# Altium schematic sheet charger_module.SchDoc
size A4
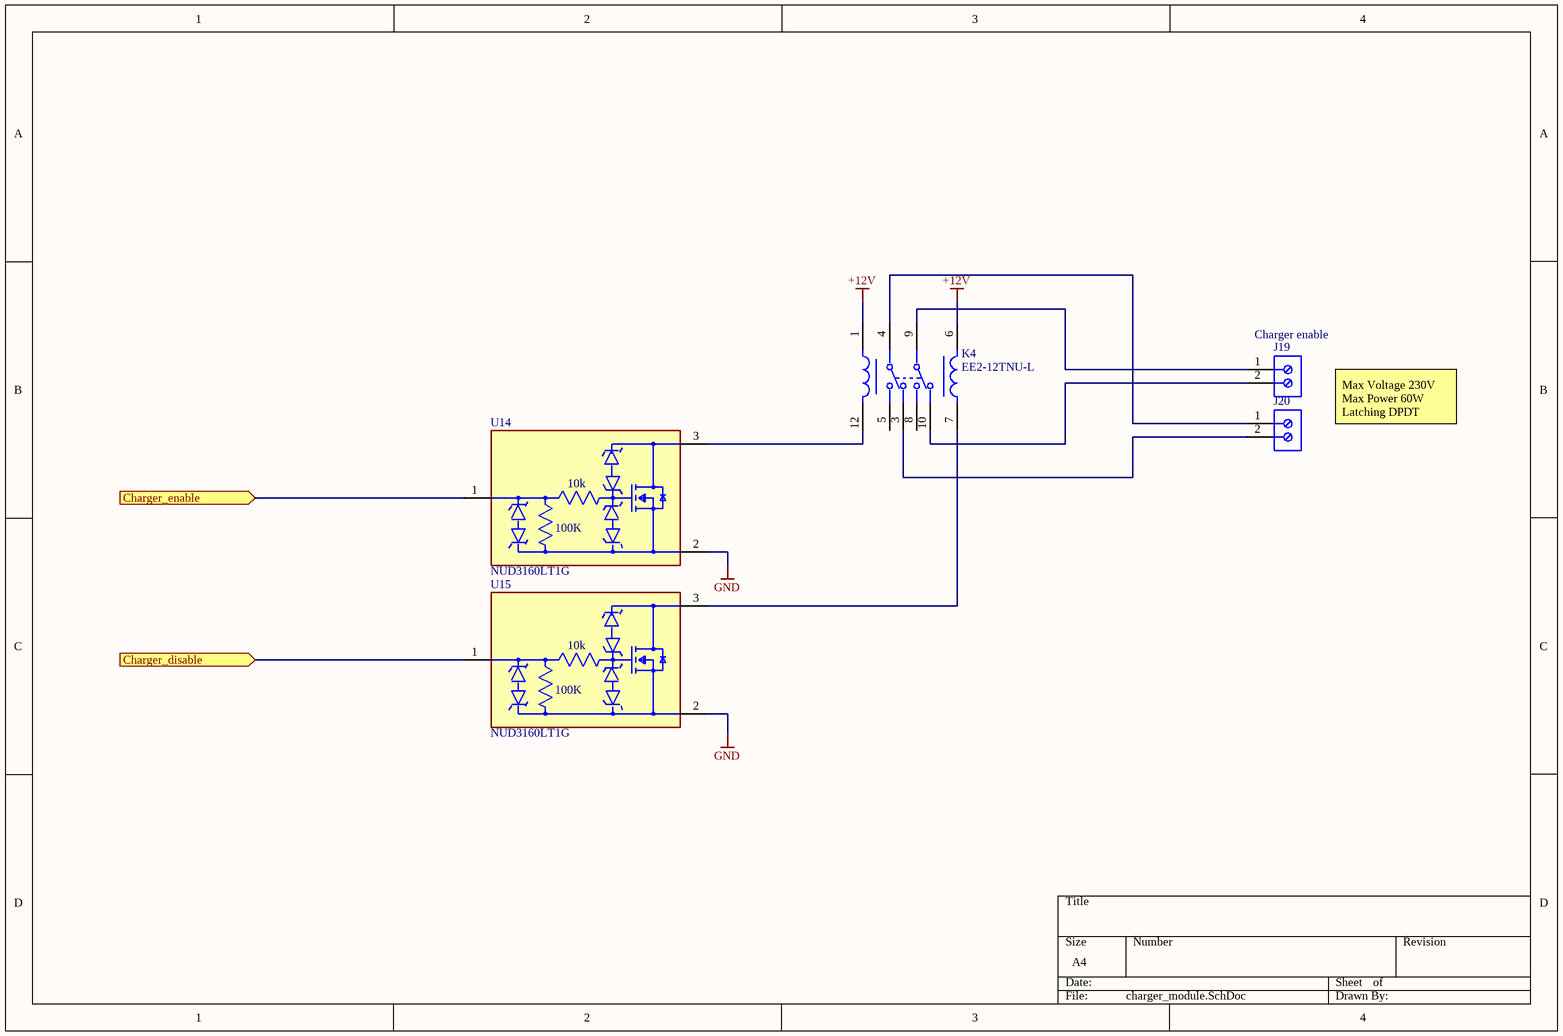
[diagram p0: charger_module.SchDoc]

## Parts
J19  282836-2  [TECO-282836-2_V]  (value not drawn)
J20  282836-2  [TECO-282836-2_V]  (value not drawn)
K4  EE2-12TNU-L  [FP-EE2-12TNU-L-MFG]
U14  NUD3160LT1G  [FP-318-08-MFG]
U15  NUD3160LT1G  [FP-318-08-MFG]

## Ports
Charger_disable (in), Charger_enable (in)

## Nets
+12V: K4.1(SET+) K4.6(RESET+)
GND: U14.2(Source) U15.2(Source)
Charger_disable: U15.1(Gate) ; port Charger_disable
Charger_enable: U14.1(Gate) ; port Charger_enable
NetJ19_1: J19.1 K4.9
NetJ19_2: J19.2 K4.10
NetJ20_1: J20.1 K4.4
NetJ20_2: J20.2 K4.3
NetK4_7: K4.7(RESET-) U15.3(Drain)
NetK4_12: K4.12(SET-) U14.3(Drain)

Not connected (* = marked no-connect by the designer): K4 5 8

## Notes on the sheet
- (near J19) Charger enable
- Max Voltage 230V
  Max Power 60W
  Latching DPDT
- (in symbol CMP-07123-000002-1) 10k; 100K

## Library data of the parts
J19 J20 = CMP-1684-00017-1: Female Header, Pitch 5 mm, 1 x 2 Position, Height 10 mm, Tail Length 3.5 mm, Rohs, Bulk; Manufacturer: TE Connectivity; Wire Gauge: 16-30AWG; Product Training Modules: Wire-to-BoardEurostyleTerminalBlocks; Clamp Material - Plating: Brass-NickelPlated; Voltage: 300V; Mating Orientation: HorizontalwithBoard; Current: 13.5A; Pitch: 0.197"(5.00mm); Screw Thread: M3; 3D Model: 282836-2.pdf; Other Names: 5ULV-02B / A98076; Dynamic Catalog: BuchananSeries; Number of Levels: 1; Torque - Screw: 0.68Nm(6Lb-In); Featured Product: EurostyleTerminalBlockConnectors; Positions Per Level: 2; Wire Termination: Screw-RisingCageClamp; Datasheet URL: http://www.te.com.cn/commerce/DocumentDelivery/DDEController?Action=showdoc&DocId=Catalog+Section%7F1308389_EUROSTYLE_TERMINAL_BLOCKS%7F0607%7Fpdf%7FEnglish%7FENG_CS_1308389_EUROSTYLE_TERMINAL_BLOCKS_0607.pdf%7F282836-2; Color: Green; Family: TerminalBlocks-WiretoBoard; RoHS Information: 282836-2StatementofCompliance; Standard Package: 300; Contact Material - Plating: Brass-TinPlated; Manufacturer URL: http://www.te.com; Housing Material: Polyamide(PA66),Nylon6/6; Features: Interlocking(Side); Package Description: Female Header, Pitch 5 mm, 1 x 2 Position, Height 10 mm, Tail Length 3.5 mm; Mounting Type: ThroughHole; Package Reference: THD; Packaging: Bulk; Series: Buchanan; Category: Connectors,Interconnects; Screw Material - Plating: Brass-NickelPlated
K4 = CMP-03195-000019-1: RELAY GEN PURPOSE DPDT 2A 12VDC; Coil Power: 140mW; Operate Time: 2ms; Release Time: 1ms; Relay Type: General Purpose; Max Voltage Rating (DC): 220V; Coil Current: 11.7mA; Coil Type: Latching, Dual Coil; Coil Voltage (DC): 12V; Coil Resistance: 1.028kR; Max Voltage Rating (AC): 250V; Number of Poles: 1; Length: 15mm; Contact Current Rating: 2A; Height: 9mm; Radiation Hardening: No; Package Quantity: 500; Throw Configuration: DPDT; Max Operating Temperature: 85°C; REACH SVHC: No SVHC; Current Rating: 2A; Number of Pins: 10; Packaging: Tape and Reel; Power Consumption: 140mW; Termination: Gull Wing; RoHS Compliant: Yes; Mount: Surface Mount; Max Current Rating: 2A; Min Operating Temperature: -40°C; Contact Material: Gold; Depth: 7.5mm
U14 U15 = CMP-07123-000002-1: IC INDCT LOAD DRVR INDUST SOT23; Manufacturer: ON Semiconductor; Max Power Dissipation: 225mW; Fall Time: 622ns; Max Supply Voltage: 60V; Propagation Delay: 1160ns; Output Current: 150mA; Output Voltage: 48V; Standoff Height: 0.01mm; Number Of Outputs: 1; Max Junction Temp: +150°C; Rise Time: 600ns; Temperature Range Low: -40°C; Mouser Description: MOSFET 61V Industrial Load Driver; Ambient Temperature Range High: +125°C; Octopart: https://octopart.com/nud3160lt1g-on+semiconductor-470723; Package: 318-08; Automotive: No; Temperature: -40°C to +150°C; RoHS: TRUE; Lead Free: Yes; Height: 1.11mm; Device Class L3: Gate Drivers; Ambient Temperature Range Low: -40°C; Device Class L2: Power Management ICs; Digikey Description: IC INDCT LOAD DRVR INDUST SOT23; Category: IC; Device Class L1: Integrated Circuits (ICs); Manufacturer Part Number: NUD3160LT1G; Footprint Url: https://www.onsemi.com/pub/Collateral/318-08.PDF; Number Of Drivers: 1; ComponentLink2Description: Datasheet; Temperature Range High: +150°C; ComponentLink2URL: https://www.onsemi.com/pub/Collateral/NUD3160-D.PDF